# EAGLE design main 1.0.0 (EAGLE 9.6.2)
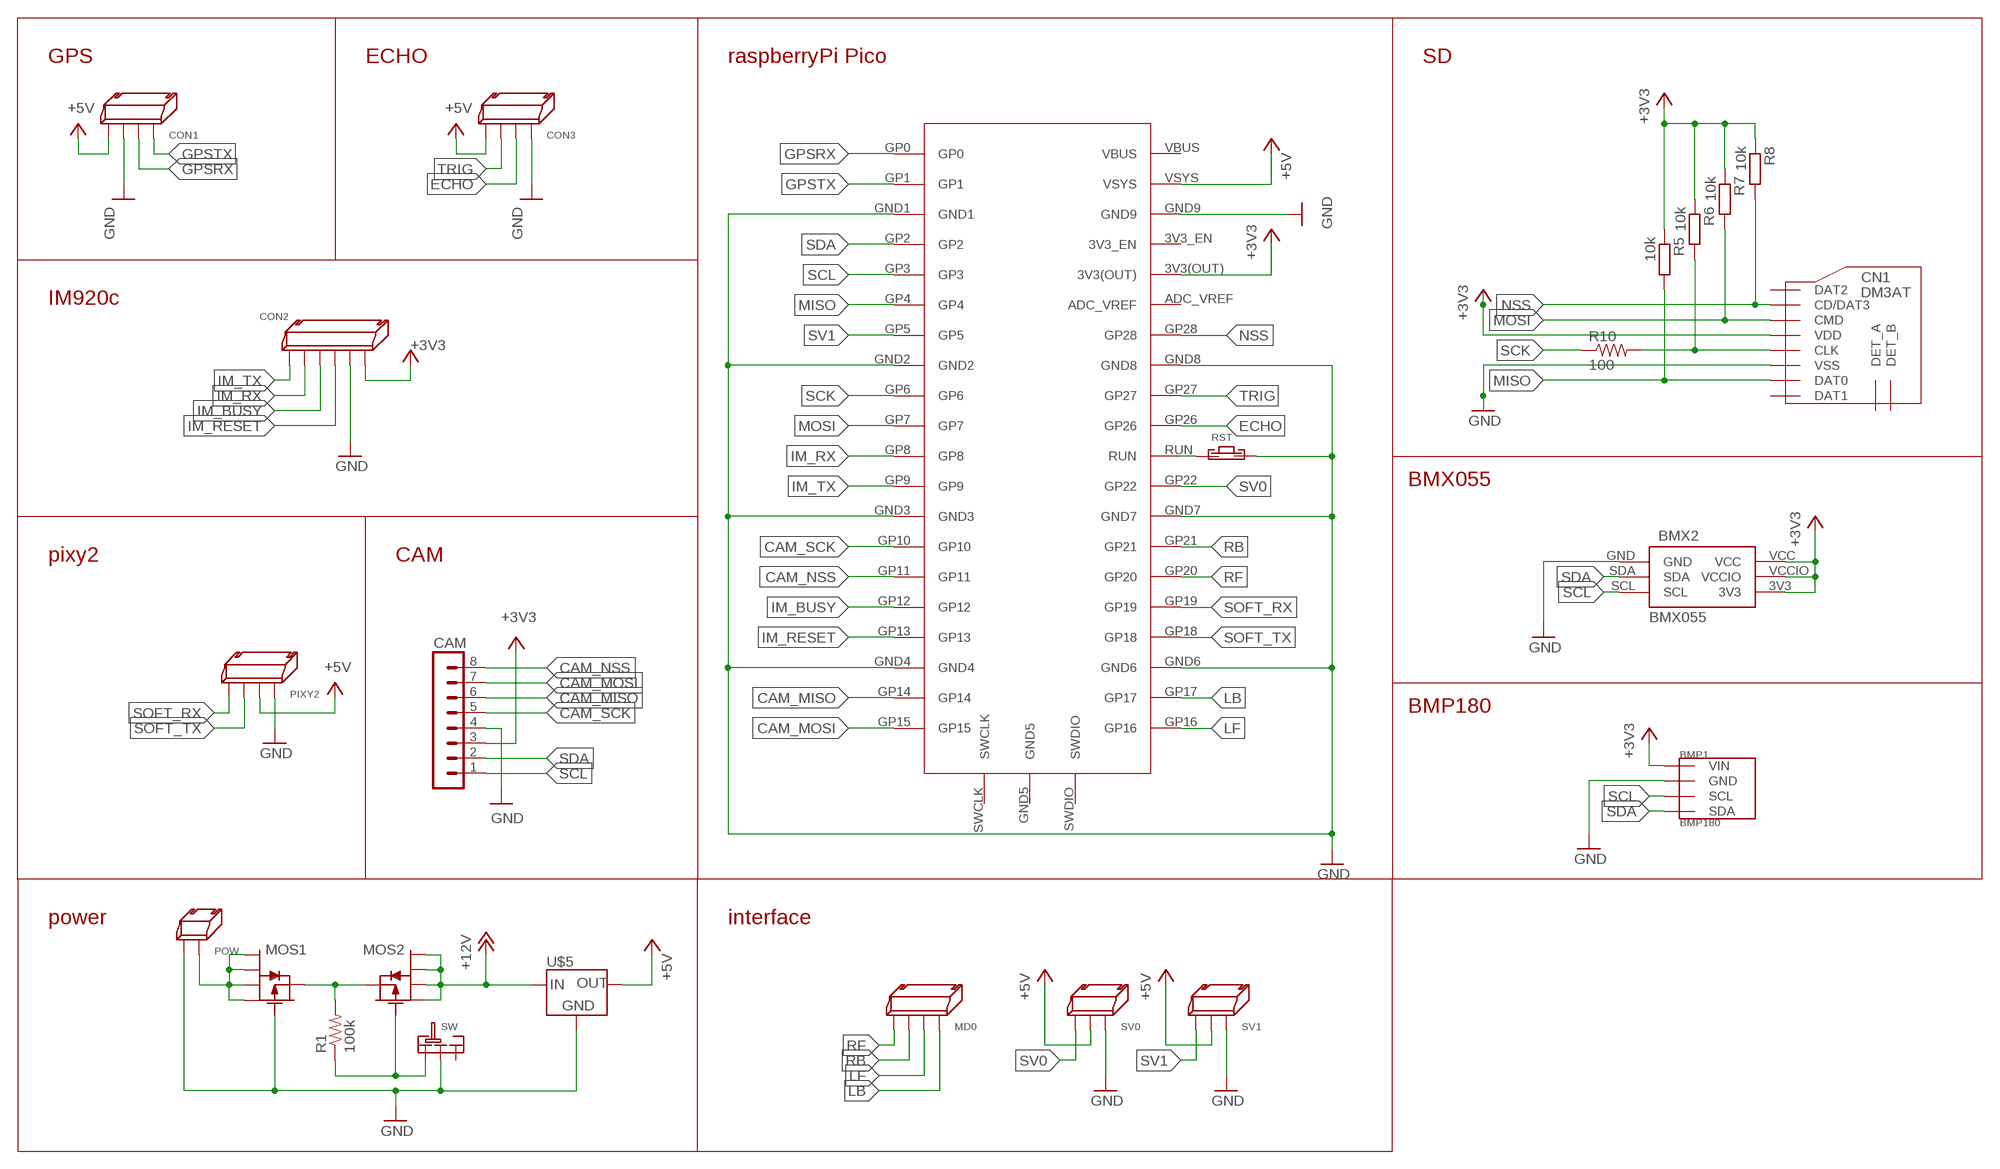
[diagram p0: schematic, sheet 1]

## Parts
BMP1  BMP180  [GY-68]
BMX2  BMX055  [BMX055]
CAM  MA08-1  [MA08-1]
CN1  DM3AT  [DM3AT]
CON1  4PIN_SIDE  [4PIN_SIDE]
CON2  6PIN_SIDE  [6PIN_SIDE]
CON3  4PIN_SIDE  [4PIN_SIDE]
MD0  4PIN_SIDE  [4PIN_SIDE]
MOS1  PCH_SSM6J808R  [SSM6J808R]
MOS2  PCH_SSM6J808R  [SSM6J808R]
PIXY2  4PIN_SIDE  [4PIN_SIDE]
POW  2PIN_SIDE  [2PIN_SIDE]
R1  100k  R-US_R0603  [R0603]
R5  10k  R-EU_R0603  [R0603]
R6  10k  R-EU_R0603  [R0603]
R7  10k  R-EU_R0603  [R0603]
R8  10k  R-EU_R0603  [R0603]
R10  100  R-US_R0603  [R0603]
RST  TVAF06-A020B-R  [TVAF06-A020B-R]
SV0  3PIN_SIDE  [3PIN_SIDE]
SV1  3PIN_SIDE  [3PIN_SIDE]
SW  SRIDE_SWITCH  [SRIDE_SWITCH]
U$1  RASPBERRYPIPICO  [RASPBERRYPIPICO]
U$5  LT1117-5  [SOT-223]

## Nets
1: CN1.CLK R6.2 R10.2
+3V3: BMP1.P1(VIN) BMX2.3V3 BMX2.VCC BMX2.VCCIO CAM.3 CN1.VDD CON2.P$6 R5.1 R6.1 R7.1 R8.1 U$1.3V3(OUT)
+5V: CON1.P$2 CON3.P$2 PIXY2.P$3 SV0.P$1 SV1.P$1 U$1.VSYS U$5.2(OUT)
+12V: MOS2.1 MOS2.2 MOS2.5 MOS2.6 U$5.3(IN)
CAM_MISO: CAM.6 U$1.GP14
CAM_MOSI: CAM.7 U$1.GP15
CAM_NSS: CAM.8 U$1.GP11
CAM_SCK: CAM.5 U$1.GP10
ECHO: CON3.P$3 U$1.GP26
GND: BMP1.P2(GND) BMX2.GND CAM.4 CN1.VSS CON1.P$1 CON2.P$5 CON3.P$4 MOS1.3 PIXY2.P$4 POW.P$2 RST.P$2 SV0.P$3 SV1.P$3 SW.LR U$1.GND1 U$1.GND2 U$1.GND3 U$1.GND4 U$1.GND6 U$1.GND7 U$1.GND8 U$5.4(GND)
GPSRX: CON1.P$3 U$1.GP0
GPSTX: CON1.P$4 U$1.GP1
IM_BUSY: CON2.P$3 U$1.GP12
IM_RESET: CON2.P$4 U$1.GP13
IM_RX: CON2.P$2 U$1.GP8
IM_TX: CON2.P$1 U$1.GP9
LB: MD0.P$4 U$1.GP17
LF: MD0.P$3 U$1.GP16
MISO: CN1.DAT0 R5.2 U$1.GP4
MOSI: CN1.CMD R7.2 U$1.GP7
N$2: RST.P$1 U$1.RUN
N$4: U$1.GND9 ; supply symbol labelled GND
N$6: MOS1.4 MOS2.4 R1.2
N$7: MOS2.3 R1.1 SW.L
N$8: MOS1.1 MOS1.2 MOS1.5 MOS1.6 POW.P$1
NSS: CN1.CD/DAT3 R8.2 U$1.GP28
RB: MD0.P$1 U$1.GP21
RF: MD0.P$2 U$1.GP20
SCK: R10.1 U$1.GP6
SCL: BMP1.P3(SCL) BMX2.SCL CAM.1 U$1.GP3
SDA: BMP1.P4(SDA) BMX2.SDA CAM.2 U$1.GP2
SOFT_RX: PIXY2.P$2 U$1.GP19
SOFT_TX: PIXY2.P$1 U$1.GP18
SV0: SV0.P$2 U$1.GP22
SV1: SV1.P$2 U$1.GP5
TRIG: CON3.P$1 U$1.GP27
Unconnected: CN1.DAT1 CN1.DAT2 CN1.DET_A CN1.DET_B SW.R U$1.3V3_EN U$1.ADC_VREF U$1.GND5 U$1.SWCLK U$1.SWDIO U$1.VBUS

## Notes on the sheet
- GPS | ECHO | raspberryPi Pico | SD
- IM920c
- BMX055
- pixy2 | CAM
- BMP180
- power | interface

## Library data of the parts
BMP1 = BMP180:BMP180
BMX2 = BMX055:BMX055
CAM = con-lstb:MA08-1: PIN HEADER; OC_FARNELL: unknown; OC_NEWARK: unknown
CN1 = microSD:DM3AT
CON1 CON3 MD0 PIXY2 = XR Connector:4PIN_SIDE
CON2 = XR Connector:6PIN_SIDE
MOS1 MOS2 = Chip MOSFET:PCH_SSM6J808R
POW = XR Connector:2PIN_SIDE
R1 R10 = rcl:R-US_: RESISTOR, American symbol; SPICEPREFIX: R
R5-R8 = rcl:R-EU_: RESISTOR, European symbol; SPICEPREFIX: R
RST = Tact switch:TVAF06-A020B-R
SV0 SV1 = XR Connector:3PIN_SIDE
SW = Sride Switch:SRIDE_SWITCH
U$1 = Raspberry Pi Pico:RASPBERRYPIPICO
U$5 = LT1117:LT1117-5

## Board
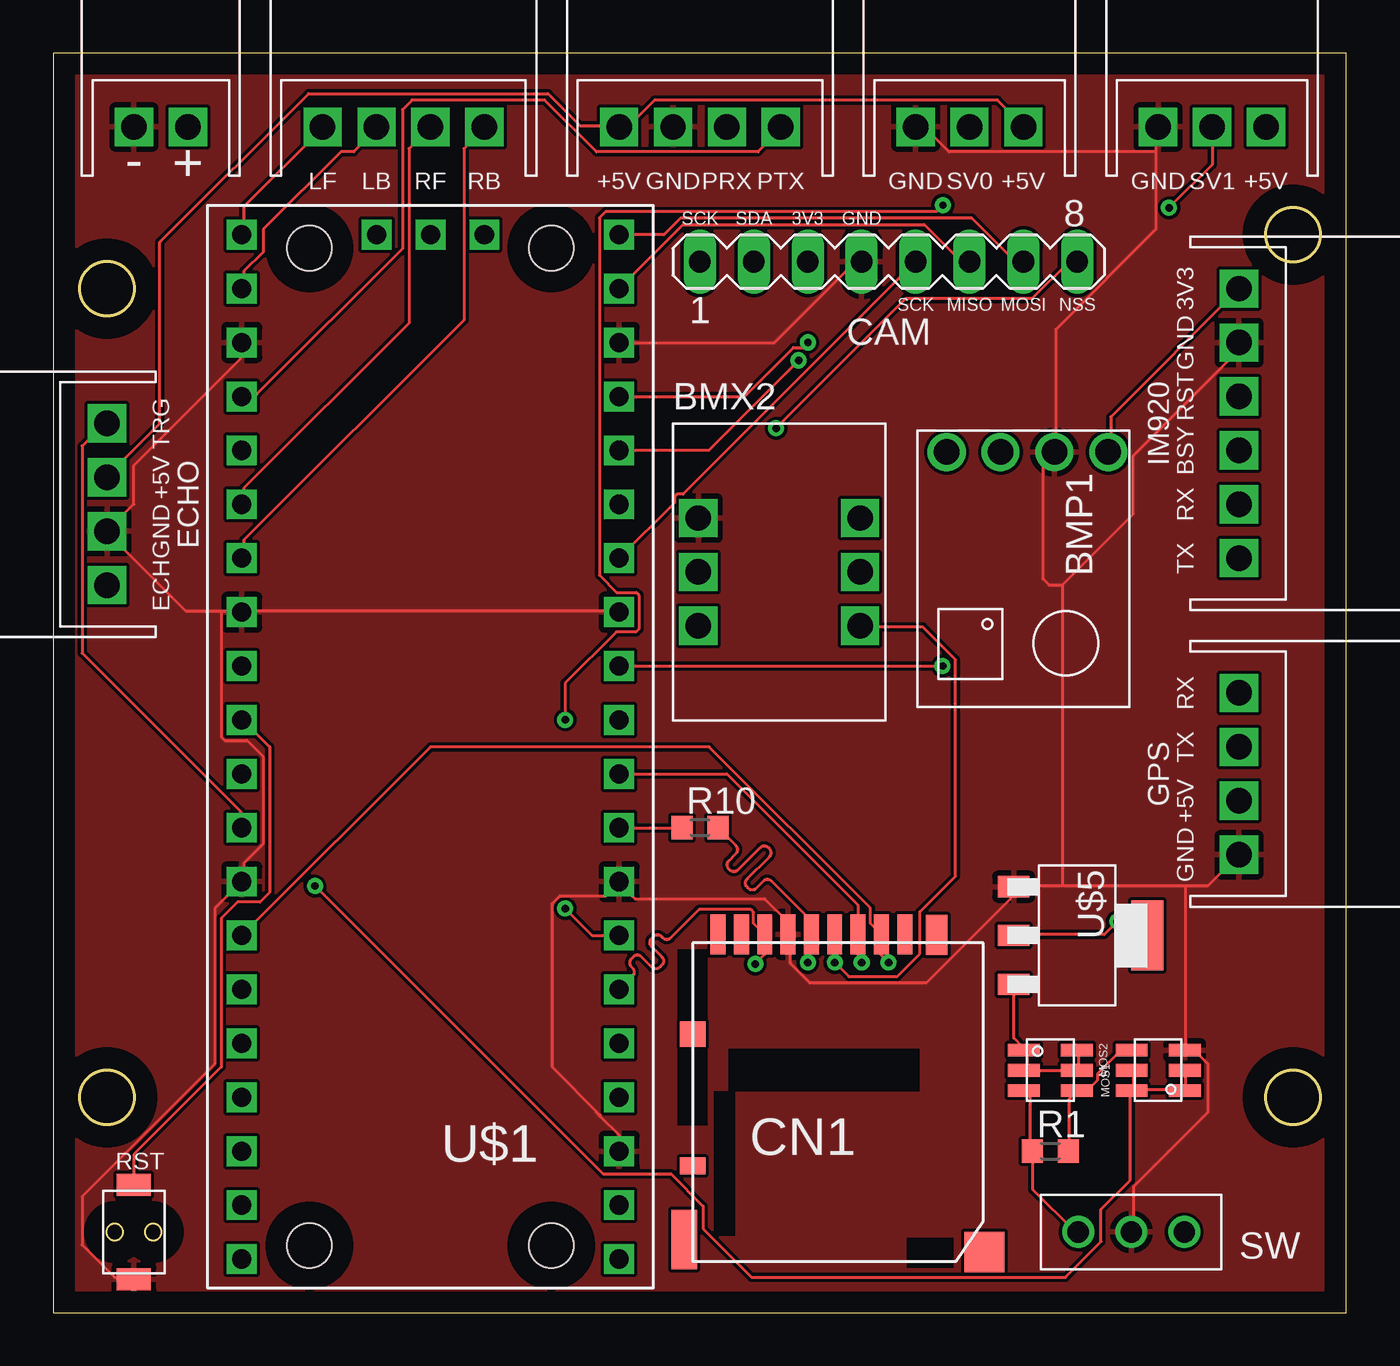
[diagram p1: board, top side]
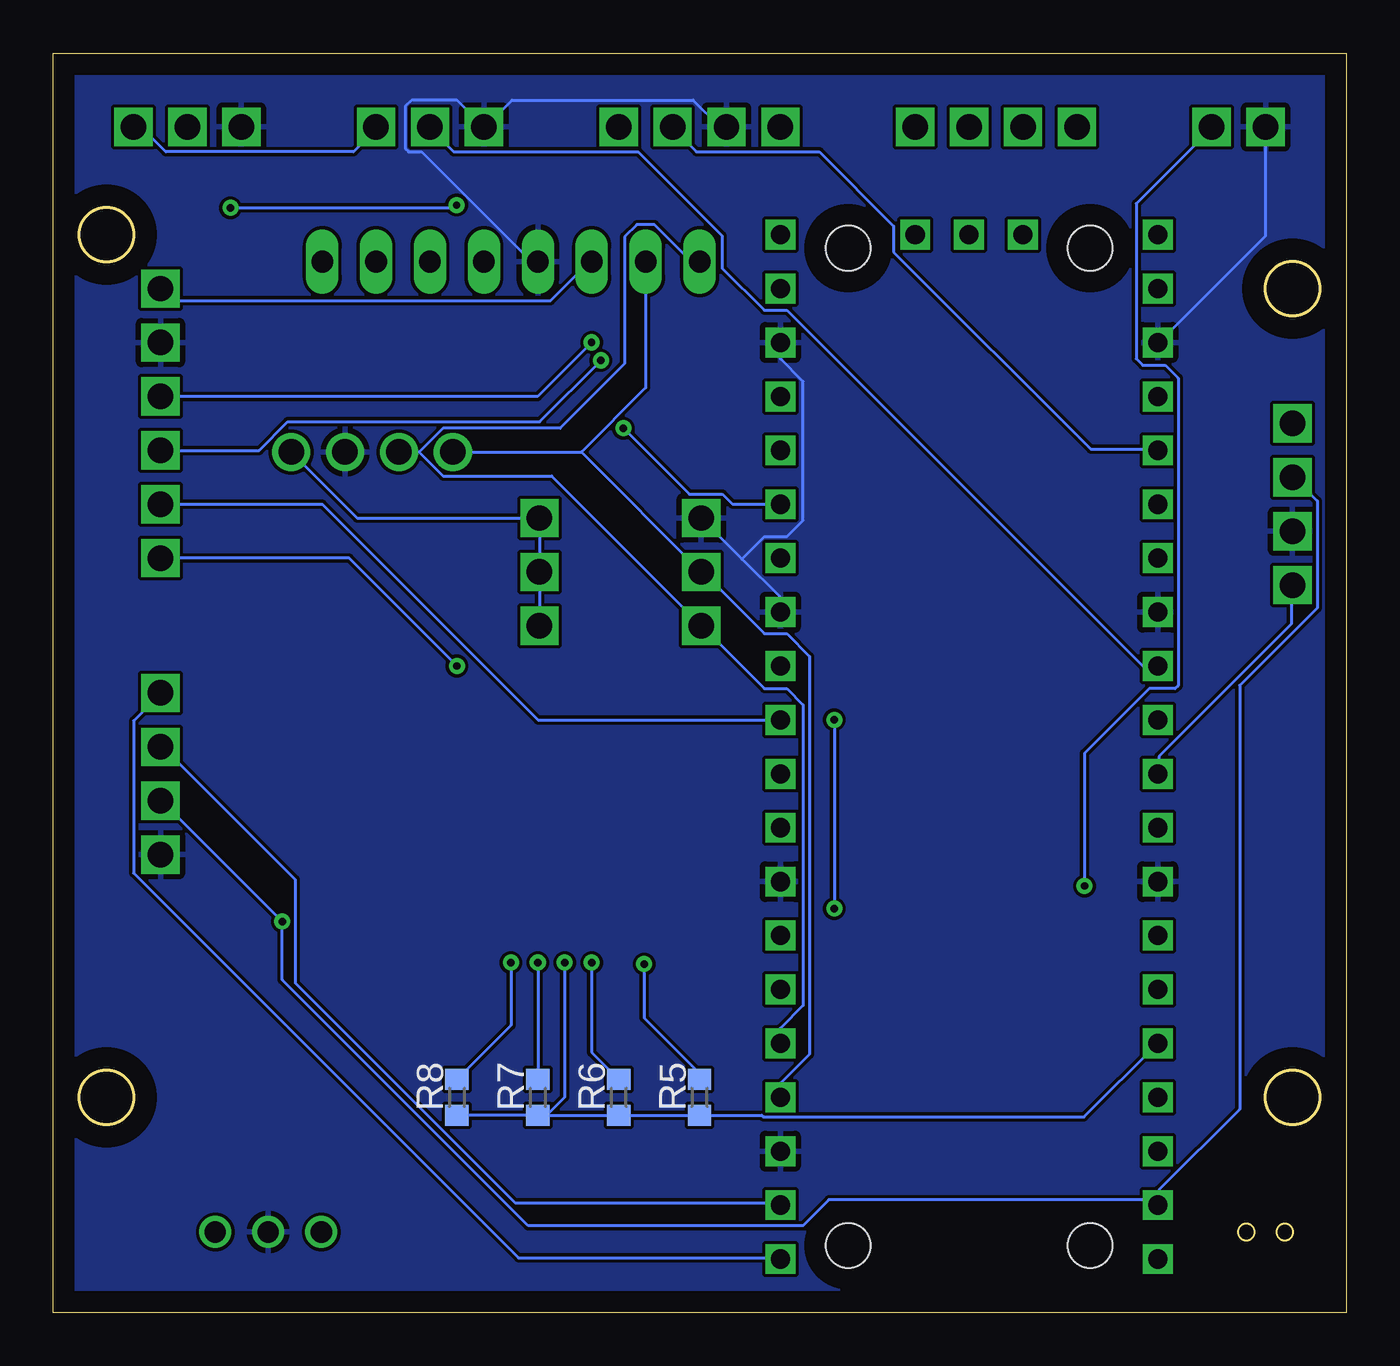
[diagram p2: board, bottom side, seen from below]

Size 60.94 x 59.36 mm. Coordinates in mm from the lower left corner, seen from the top.
Outline: 0,0 60.94,0 60.94,59.36 0,59.36 0,0
Outline: circle at 2.54,10.16 radius 1.27
Outline: circle at 58.42,10.16 radius 1.27
Outline: circle at 2.54,48.26 radius 1.27
Outline: circle at 58.42,50.8 radius 1.27
Copper layers (1*16): Top 0.035mm / dielectric 1.5mm / Bottom 0.035mm
Design rules "default": minimum track width 6mil, minimum drill 0.35mm, track to track 6mil, track to pad 6mil, pad to pad 6mil, via to via 6mil, smd to smd 6mil, copper to edge 40mil, drill to drill 6mil, minimum pad ring 10mil, minimum via ring 8mil, stop-mask expansion 4mil, vias tented up to drill 0mil, thermal gap 10mil

### Footprints (pad centres in the part's own frame; a part is rotated, then mirrored left to right if it is on the bottom)
GY-68 = drill 1.2: P1 -5,4; P2 -5,1.46; P3 -5,-1.08; P4 -5,-3.62
BMX055 = drill 1.2 pad 1.5 square: 3V3 8.81,-9.53; GND 1.19,-4.46; SCL 1.19,-9.53; SDA 1.19,-7; VCC 8.81,-4.46; VCCIO 8.81,-7
MA08-1 = drill 1.016 long: 1 -8.89,0; 2 -6.35,0; 3 -3.81,0; 4 -1.27,0; 5 1.27,0; 6 3.81,0; 7 6.35,0; 8 8.89,0
DM3AT = smd 0.7 x 1.9: CD/DAT3 2.2,6.4; CLK -1.1,6.4; CMD 1.1,6.4; DAT0 -3.3,6.4; DAT1 -4.4,6.4; DAT2 3.3,6.4; DET_B -5.5,6.4; VDD 0,6.4; VSS -2.2,6.4 | smd 1.2 x 0.8: DET_A -6.7,-4.5 | smd 1 x 1.9: P$9 4.8,6.381 | smd 1.2 x 1.2: P$11 -6.7,1.7 | smd 1.2 x 2.8: P$13 -7.081,-7.973 | smd 1.9 x 1.9: P$14 7.054,-8.562
4PIN_SIDE = drill 1.2 square: P$1 -3.81,0; P$2 -1.27,0; P$3 3.81,0; P$4 1.27,0
6PIN_SIDE = drill 1.2 square: P$1 -6.35,0; P$2 -3.81,0; P$3 -1.27,0; P$4 1.27,0; P$5 3.81,0; P$6 6.35,0
SSM6J808R = smd 0.6 x 1.5: 1 -0.95,-1.25; 2 0,-1.25; 3 0.95,-1.25; 4 0.95,1.25; 5 0,1.25; 6 -0.95,1.25
2PIN_SIDE = drill 1.2 square: P$1 -1.27,0; P$2 1.27,0
R0603 = smd 1 x 1.1: 1 -0.85,0; 2 0.85,0
TVAF06-A020B-R = smd 1.6 x 1.05: P$1 0,2.225; P$2 0,-2.225
3PIN_SIDE = drill 1.2 square: P$1 -2.54,0; P$2 0,0; P$3 2.54,0
SRIDE_SWITCH = drill 1: L -2.5,0; LR 0,0; R 2.5,0
RASPBERRYPIPICO = drill 0.9 square: 3V3(OUT) 8.89,13.97; 3V3_EN 8.89,16.51; ADC_VREF 8.89,11.43; GND1 -8.89,19.05; GND2 -8.89,6.35; GND3 -8.89,-6.35; GND4 -8.89,-19.05; GND5 0,-24.13; GND6 8.89,-19.05; GND7 8.89,-6.35; GND8 8.89,6.35; GND9 8.89,19.05; GP0 -8.89,24.13; GP1 -8.89,21.59; GP2 -8.89,16.51; GP3 -8.89,13.97; GP4 -8.89,11.43; GP5 -8.89,8.89; GP6 -8.89,3.81; GP7 -8.89,1.27; GP8 -8.89,-1.27; GP9 -8.89,-3.81; GP10 -8.89,-8.89; GP11 -8.89,-11.43; GP12 -8.89,-13.97; GP13 -8.89,-16.51; GP14 -8.89,-21.59; GP15 -8.89,-24.13; GP16 8.89,-24.13; GP17 8.89,-21.59; GP18 8.89,-16.51; GP19 8.89,-13.97; GP20 8.89,-11.43; GP21 8.89,-8.89; GP22 8.89,-3.81; GP26 8.89,1.27; GP27 8.89,3.81; GP28 8.89,8.89; RUN 8.89,-1.27; SWCLK -2.54,-24.13; SWDIO 2.54,-24.13; VBUS 8.89,24.13; VSYS 8.89,21.59 | hole 2.1: -5.7,23.5; 5.7,23.5; -5.7,-23.5; 5.7,-23.5
SOT-223 = smd 3.3 x 1.5: 1 0,3.3 | smd 1 x 1.5: 2 0,-3; 3 2.3,-3; 4 -2.3,-3

### Placement (x,y rotation side)
BMP1  45.72,35.56 270 top
BMX2  29.21,41.91 0 top
CAM  39.37,49.53 0 top
CN1  36.83,11.43 0 top
CON1  55.88,25.4 90 top
CON2  55.88,41.91 90 top
CON3  2.54,38.1 270 top
MD0  16.51,55.88 180 top
MOS1  52.07,11.43 90 top
MOS2  46.99,11.43 270 top
PIXY2  30.48,55.88 180 top
POW  5.08,55.88 180 top
R1  46.99,7.62 0 top
R5  30.48,10.16 90 bottom
R6  34.29,10.16 90 bottom
R7  38.1,10.16 90 bottom
R8  41.91,10.16 90 bottom
R10  30.48,22.86 0 top
RST  3.81,3.81 0 top
SV0  43.18,55.88 180 top
SV1  54.61,55.88 180 top
SW  50.8,3.81 0 top
U$1  17.78,26.67 180 top
U$5  48.26,17.78 270 top

### Tracks (layer width: path | path; a pad name or v marks a point on that pad's centre or on a via)
1  (via drill 0.35)
  Top 0.152: R10.2 32.17,22.02 arc-90 32.17,21.64 31.84,21.3 arc90 31.84,20.92 31.89,20.87 arc90 32.27,20.87 33.32,21.92 arc-90 33.7,21.92 33.75,21.87 arc-90 33.75,21.49 32.7,20.44 arc90 32.7,20.06 32.75,20.01 arc90 33.13,20.01 33.47,20.34 arc-90 33.84,20.34 35.73,18.46 CN1.CLK 35.56,17.66 v35.56,16.51
  Bottom 0.152: v35.56,16.51 35.56,12.28 R6.2
+3V3  (via drill 0.35)
  Top 0.152: CN1.VDD v36.83,16.51 37.49,15.85 39.78,15.85 40.84,16.92 40.84,18.9 42.52,20.57 42.52,30.79 41,32.31 38.1,32.31 BMX2.3V3 | CON2.P$6 49.84,42.22 49.84,40.69 BMP1.P1
  Bottom 0.152: v36.83,16.51 36.83,10.16 37.68,9.31 R7.1 | R7.1 R6.1 R5.1 27.55,9.31 27.47,9.23 12.36,9.23 U$1.3V3(OUT) | R7.1 R8.1 | BMX2.3V3 BMX2.VCCIO BMX2.VCC 46.61,37.45 BMP1.P1 | CON2.P$6 55.32,47.7 37.49,47.7 35.66,49.53 CAM.3
+5V  (via drill 0.35)
  Top 0.152: 26.67,55.93 27.13,55.93 28.35,57.15 44.5,57.15 45.72,55.93 SV0.P$1 | v50.14,18.44 49.53,17.83 45.26,17.83 U$5.2 | 26.67,55.93 24.84,55.93 23.32,57.45 12.04,57.45 5.03,50.44 5.03,41.91 2.59,39.47 CON3.P$2 | 26.67,55.93 PIXY2.P$3
  Bottom 0.152: SV1.P$1 57.15,55.78 56.69,55.78 55.63,54.71 46.79,54.71 45.72,55.78 SV0.P$1 | CON1.P$2 55.78,24.08 v50.14,18.44 50.14,15.7 38.56,4.12 25.6,4.12 24.38,5.33 8.84,5.33 | 8.84,5.33 8.84,5.79 5.03,9.6 5.03,29.57 1.37,33.22 1.37,38.25 2.44,39.32 CON3.P$2 | 8.84,5.33 8.84,5.18 U$1.VSYS 8.84,5.33
+12V
  Top 0.152: MOS2.6 48.31,12.34 48.31,11.43 MOS2.5 45.87,11.43 | 45.87,11.43 45.87,12.34 MOS2.1 45.72,12.5 45.26,12.95 45.26,15.39 U$5.3 | 45.87,11.43 MOS2.2
CAM_MISO
  Top 0.152: CAM.6 42.8,49.53 41.05,51.28 29.69,51.28 U$1.GP14
CAM_MOSI
  Top 0.152: CAM.7 45.34,49.53 43.29,51.59 29.57,51.59 28.78,50.8 U$1.GP15
CAM_NSS  (via drill 0.35)
  Top 0.152: CAM.8 47.88,49.53 46.13,47.78 40.16,47.78 v34.07,41.69
  Bottom 0.152: v34.07,41.69 30.96,38.58 29.41,38.58 28.93,38.1 U$1.GP11
CAM_SCK
  Top 0.152: CAM.5 29.69,38.58 29.41,38.58 29.27,38.45 29.27,38.16 U$1.GP10
ECHO
  Bottom 0.152: U$1.GP26 8.84,25.45 8.84,26.21 2.59,32.46 2.59,34.29 CON3.P$3
GND
  Top 0.152: RST.P$2 3.81,1.68 2.9,1.68 1.37,3.2 1.37,5.49 7.62,11.73 7.62,19.05 U$1.GND8 8.99,20.42 8.99,21.18 9.91,22.1 9.91,26.21 9.14,26.98 8.08,26.98 7.92,27.13 7.92,33.07 | 7.92,33.07 6.25,33.07 2.59,36.73 CON3.P$4 3.81,38.1 3.81,39.93 8.84,44.96 8.84,45.72 U$1.GND6 | 7.92,33.07 8.84,33.07 U$1.GND7 8.99,33.07 26.67,33.07 U$1.GND3 | 26.67,20.27 26.98,19.96 | 26.98,19.96 27.43,19.51 33.53,19.51 34.59,18.44 34.59,17.83 CN1.VSS 34.75,17.68 34.75,16.46 35.66,15.54 41.15,15.54 45.11,19.51 45.11,19.96 U$5.4 45.26,20.12 47.55,20.12 | 26.67,20.27 U$1.GND2 26.98,19.96 | U$1.GND1 26.67,8.38 25.78,9.27 | 25.6,9.45 25.78,9.27 | 53.34,20.12 54.41,20.12 CON1.P$1 | 53.34,20.12 47.55,20.12 | 53.34,20.12 53.34,12.5 MOS1.3 53.34,12.34 53.8,12.34 54.41,11.73 54.41,9.45 50.9,5.94 50.9,3.81 SW.LR | CAM.4 37.8,49.53 33.98,45.72 U$1.GND4 | 51.97,54.71 51.97,55.78 SV1.P$3 | 51.97,54.71 51.97,51.05 47.24,46.33 47.24,40.69 BMP1.P2 47.09,40.54 46.63,40.08 46.63,34.59 46.94,34.29 47.55,34.29 | 47.55,34.29 50.9,37.64 50.9,40.39 55.78,45.26 55.78,45.72 CON2.P$5 | 51.97,54.71 42.22,54.71 41.15,55.78 40.69,55.78 SV0.P$3 | 47.55,34.29 47.55,20.12 | 25.78,9.27 25.78,9.32 23.52,11.58 23.52,19.3 23.88,19.66 26.06,19.66 26.67,20.27
  Bottom 0.152: BMX2.GND 28.48,35.53 | 28.48,35.53 26.67,33.72 U$1.GND3 | POW.P$2 3.81,50.75 8.84,45.72 U$1.GND6 | U$1.GND4 26.67,44.96 25.6,43.89 25.6,37.34 26.36,36.58 27.43,36.58 28.48,35.53 | 28.5,35.51 28.48,35.53 | PIXY2.P$4 29.26,55.93 29.57,55.93 30.79,57.15 39.32,57.15 40.54,55.93 SV0.P$3 41.91,57.15 44.04,57.15 44.35,56.84 44.35,54.86 44.2,54.71 43.59,54.71 38.41,49.53 CAM.4
  pour Top: -1.27,60.96 62.23,60.96 62.23,-1.27 -1.27,-1.27
  pour Bottom: -1.27,60.96 62.23,60.96 62.23,-1.27 -1.27,-1.27
GPSRX
  Bottom 0.152: U$1.GP0 26.67,2.59 39.01,2.59 57.15,20.73 57.15,27.89 55.93,29.11 CON1.P$3
GPSTX
  Bottom 0.152: U$1.GP1 26.67,5.18 39.17,5.18 49.53,15.54 49.53,20.42 55.78,26.67 CON1.P$4
IM_BUSY  (via drill 0.35)
  Top 0.152: v35.13,44.88 30.89,40.64 U$1.GP12
  Bottom 0.152: v35.13,44.88 38.02,41.99 49.88,41.99 51.24,40.64 CON2.P$3
IM_RESET  (via drill 0.35)
  Top 0.152: v35.57,45.73 35.33,45.49 34.88,45.49 32.57,43.18 U$1.GP13
  Bottom 0.152: v35.57,45.73 38.12,43.18 CON2.P$4
IM_RX
  Bottom 0.152: CON2.P$2 48.26,38.1 38.1,27.94 U$1.GP8
IM_TX  (via drill 0.35)
  Top 0.152: U$1.GP9 v41.91,30.48
  Bottom 0.152: v41.91,30.48 46.99,35.56 CON2.P$1
LB
  Top 0.152: U$1.GP17 8.99,48.31 8.99,49.07 9.91,49.99 9.91,51.05 13.56,54.71 14.17,54.71 15.24,55.78 MD0.P$4
LF
  Top 0.152: U$1.GP16 8.99,50.9 8.99,52.12 12.65,55.78 MD0.P$3
MISO  (via drill 0.35)
  Top 0.152: U$1.GP4 27.3,15.88 arc90 27.3,16.25 27.25,16.31 arc-90 27.25,16.69 27.34,16.79 arc-90 27.72,16.79 28.21,16.29 arc90 28.59,16.29 28.69,16.39 arc90 28.69,16.76 28.19,17.26 arc-90 28.19,17.64 28.29,17.73 arc-90 28.67,17.73 28.73,17.67 arc90 29.1,17.67 30.44,19.01 32.88,19.01 33.01,18.88 33.01,18.35 CN1.DAT0 33.53,16.88 v33.09,16.44
  Bottom 0.152: v33.09,16.44 33.09,13.9 30.48,11.29 R5.2
MOSI  (via drill 0.35)
  Top 0.152: U$1.GP7 31.75,25.4 37.93,19.22 CN1.CMD 37.93,16.68 v38.1,16.51
  Bottom 0.152: v38.1,16.51 R7.2
N$2
  Top 0.152: RST.P$1 3.81,7.47 7.92,11.58 7.92,18.59 8.69,19.36 9.75,19.36 10.21,19.81 10.21,26.67 8.99,27.89 U$1.RUN
N$6
  Top 0.152: R1.2 47.85,7.62 47.85,10.06 48.16,10.36 MOS2.4 48.31,10.52 48.77,10.52 49.23,10.97 49.23,11.28 50.29,12.34 50.75,12.34 MOS1.4
N$7
  Top 0.152: MOS2.3 45.87,10.36 46.02,10.21 46.02,7.62 R1.1 46.18,7.62 46.18,5.79 48.16,3.81 SW.L
N$8  (via drill 0.35)
  Top 0.152: 50.9,10.52 50.9,11.43 MOS1.5 | MOS1.2 53.34,11.43 53.34,10.52 MOS1.1 53.19,10.52 50.9,10.52 | 50.9,10.52 MOS1.6 50.75,10.36 50.75,6.25 49.38,4.88 49.38,3.35 47.7,1.68 32.92,1.68 30.63,3.96 30.63,5.03 29.11,6.55 25.91,6.55 v12.34,20.12
  Bottom 0.152: v12.34,20.12 12.34,26.36 9.3,29.41 8.08,29.41 7.92,29.57 7.92,44.04 8.53,44.65 9.6,44.65 9.91,44.96 9.91,52.27 6.4,55.78 POW.P$1
NSS  (via drill 0.35)
  Top 0.152: U$1.GP28 17.78,26.67 30.91,26.67 38.51,19.07 38.51,18.35 CN1.CD/DAT3 39.03,16.85 v39.37,16.51
  Bottom 0.152: v39.37,16.51 39.37,13.55 R8.2
RB
  Top 0.152: U$1.GP21 8.99,35.66 8.99,36.42 19.36,46.79 19.36,54.86 20.27,55.78 MD0.P$1
RF
  Top 0.152: MD0.P$2 16.76,54.86 16.76,46.63 8.99,38.86 8.99,38.1 U$1.GP20
SCK
  Top 0.152: U$1.GP6 R10.1
SCL
  Bottom 0.152: 43.7,40.56 42.57,39.43 37.45,39.43 BMX2.SCL 30.33,32.31 27.43,29.41 26.36,29.41 25.6,28.65 25.6,14.48 26.67,13.41 U$1.GP3 | CAM.1 30.86,49.53 32.61,51.28 33.43,51.28 34.01,50.7 34.01,44.73 37.05,41.69 42.57,41.69 43.7,40.56 | 43.7,40.56 BMP1.P3
SDA
  Bottom 0.152: BMP1.P4 36.05,40.56 | 36.05,40.56 BMX2.SDA 30.33,34.9 27.43,32 26.36,32 25.3,30.94 25.3,12.19 26.67,10.82 U$1.GP2 | CAM.2 33.02,43.59 36.05,40.56
SOFT_RX
  Bottom 0.152: U$1.GP19 8.99,40.69 12.04,40.69 21.34,49.99 21.34,51.21 24.84,54.71 30.63,54.71 31.7,55.78 PIXY2.P$2
SOFT_TX
  Top 0.152: U$1.GP18 8.99,43.28 9.6,43.28 16.46,50.14 16.46,56.69 16.92,57.15 23.16,57.15 25.6,54.71 33.22,54.71 34.29,55.78 PIXY2.P$1
SV0
  Bottom 0.152: U$1.GP22 9.6,30.48 26.36,47.24 27.43,47.24 29.41,49.23 29.41,50.75 33.38,54.71 42.06,54.71 43.13,55.78 SV0.P$2
SV1  (via drill 0.35)
  Top 0.152: SV1.P$2 54.61,54.1 v52.58,52.07 | v41.93,52.19 41.62,51.89 26.03,51.89 25.74,51.6 25.74,34.76 26.55,33.95 27.47,33.95 27.6,33.82 27.6,32.22 27.47,32.09 26.55,32.09 24.13,29.67 v24.13,27.94 | v24.13,19.05 25.4,17.78 U$1.GP5
  Bottom 0.152: v52.58,52.07 42.05,52.07 v41.93,52.19 | v24.13,27.94 v24.13,19.05
TRIG
  Top 0.152: U$1.GP27 8.84,22.86 8.84,23.62 1.37,31.09 1.37,40.84 2.44,41.91 CON3.P$1

### Text on the board
tPlace: - | + | LF | LB | RF | RB | +5V | GND | PRX | PTX | GND | SV0 | +5V | GND | SV1 | +5V | SCK | SDA | 3V3 | GND | 3V3 | SCK | MISO | MOSI | NSS | CAM | GND | RST | TRG | IM920 | BSY | +5V | ECHO | RX | GND | TX | ECH | RX | TX | GPS | +5V | GND